# EasyEDA schematic schematic.json
TITLE: Bad Grow Light; REV: 1.3; Date: 2021-09-13; Sheet: 1/1; Drawn By: Jasper; Company: Leaf Debrief
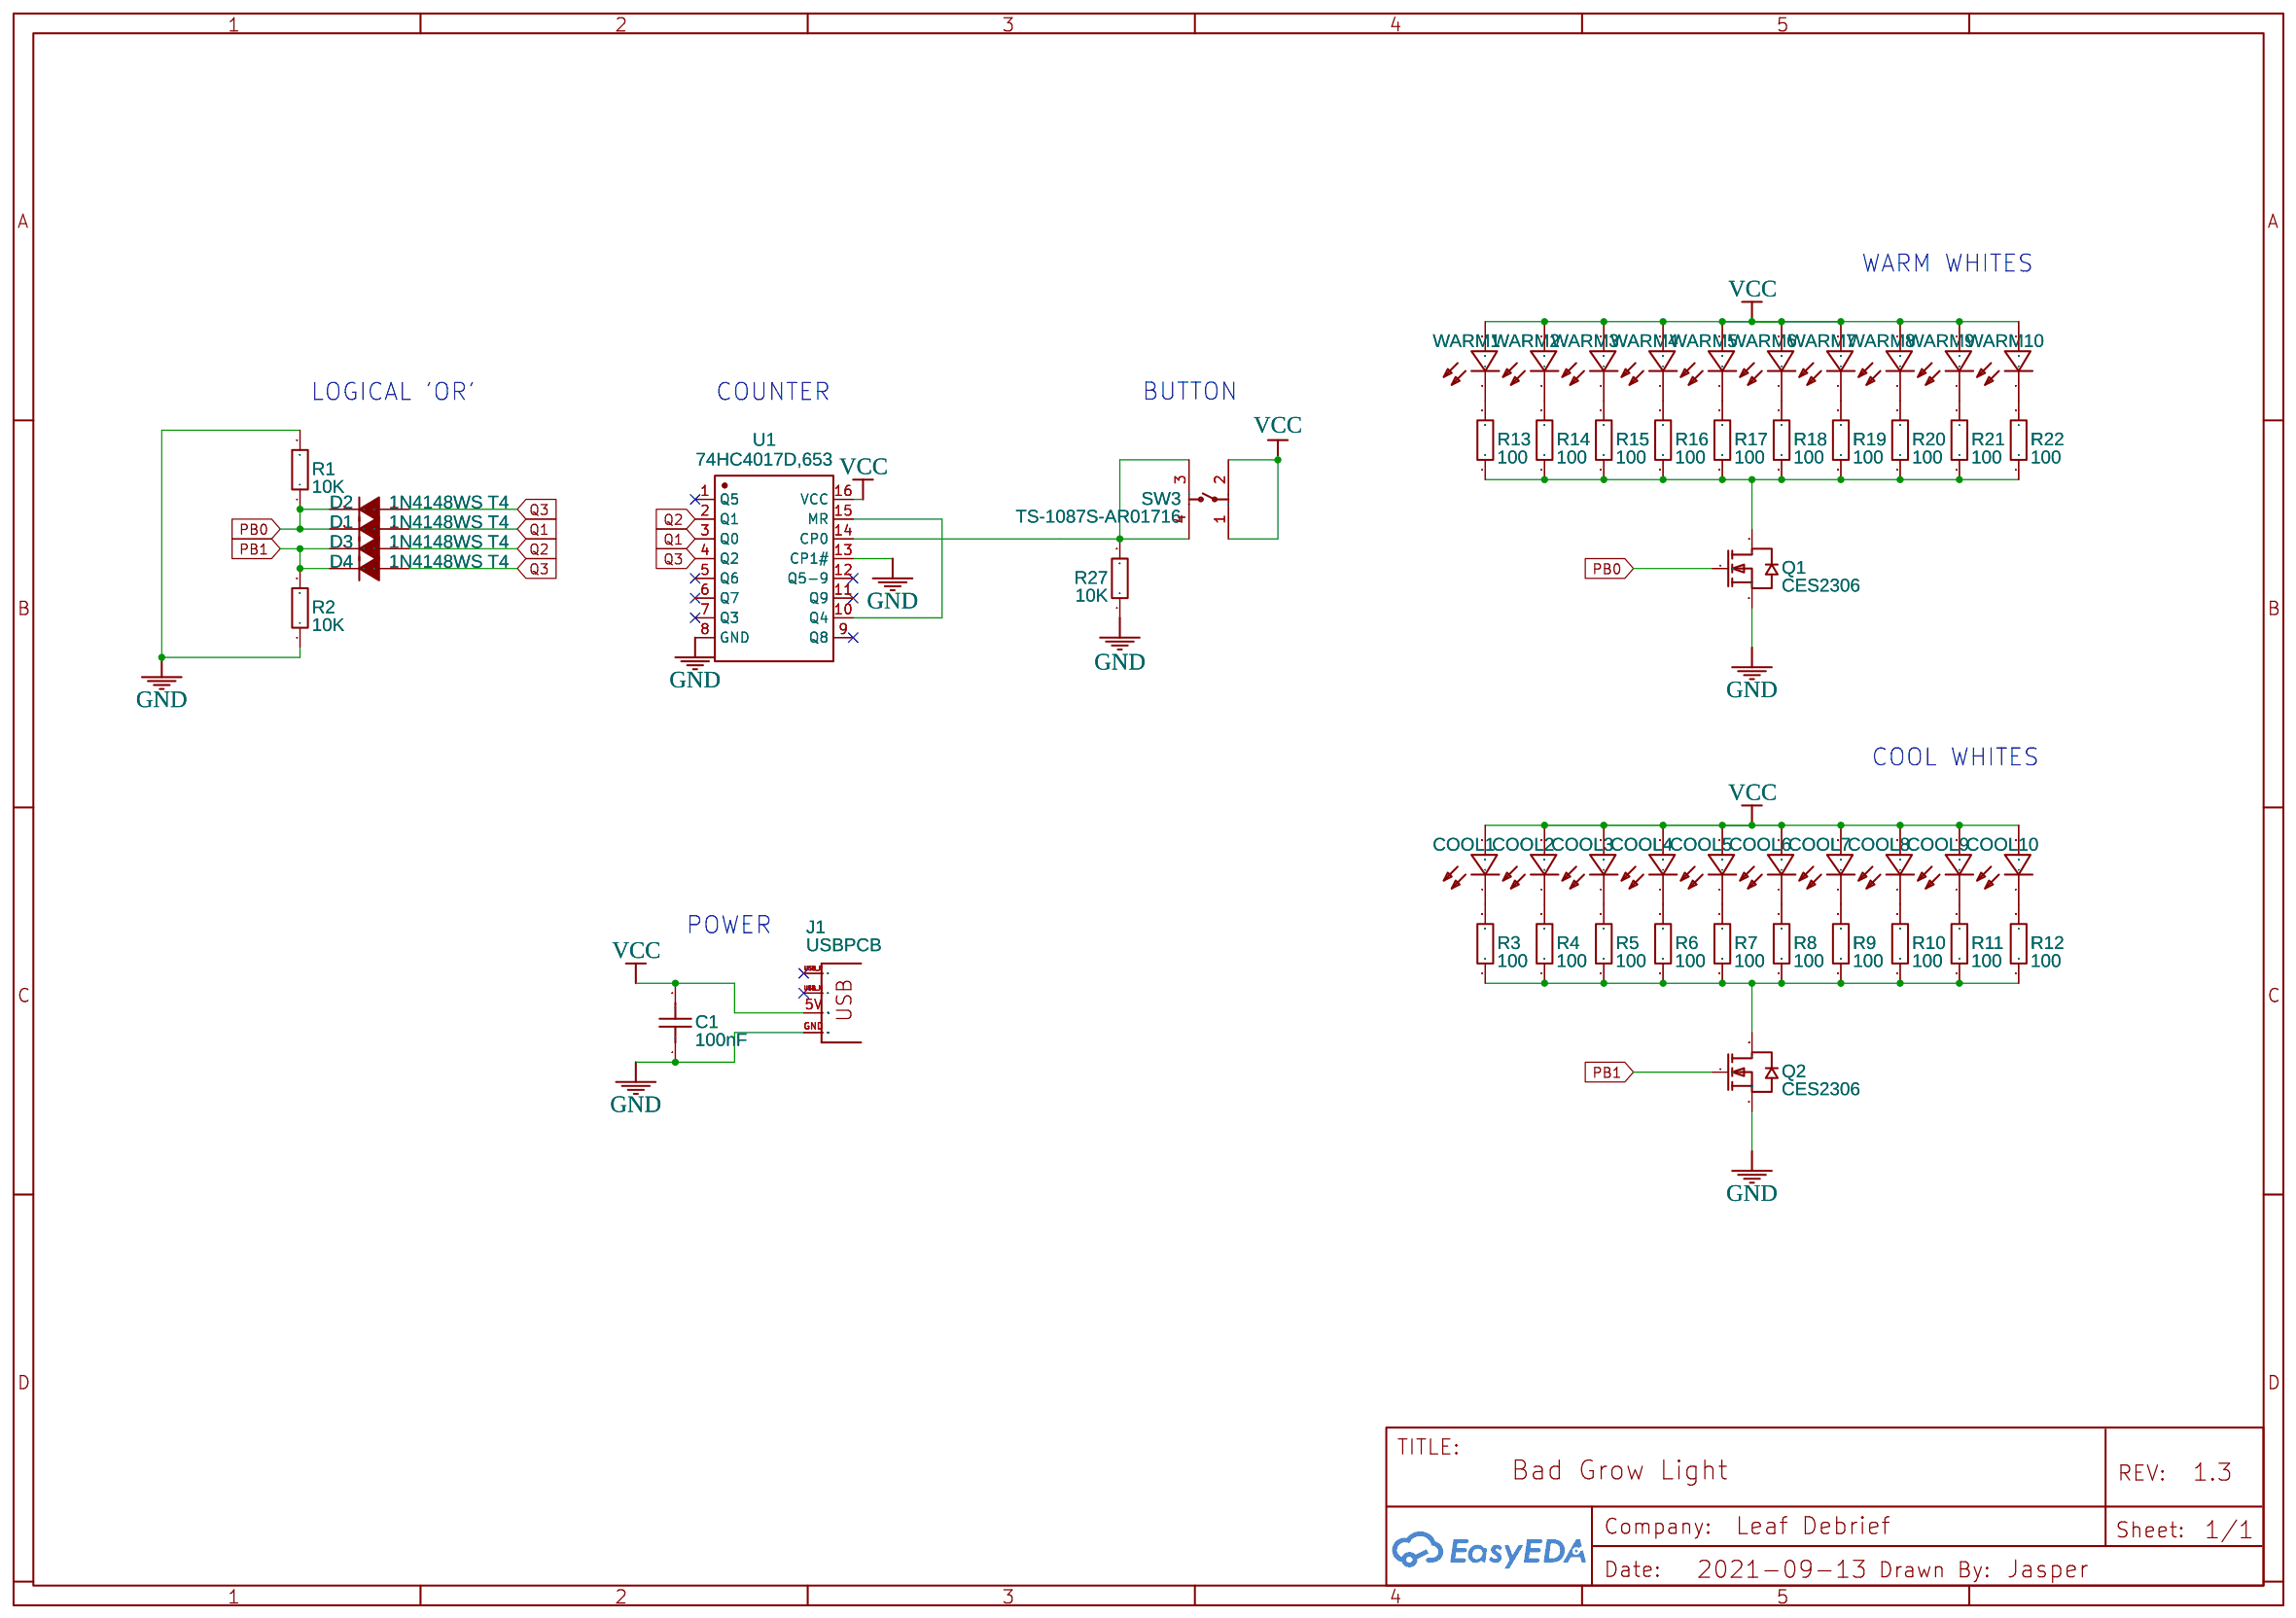
[diagram p0: schematic sheet]

## Parts
C1  100nF  [C0603]
COOL1  HL-A-3014H416W-S1-08HL-HR3_C210338  [5730]
COOL2  HL-A-3014H416W-S1-08HL-HR3_C210338  [5730]
COOL3  HL-A-3014H416W-S1-08HL-HR3_C210338  [5730]
COOL4  HL-A-3014H416W-S1-08HL-HR3_C210338  [5730]
COOL5  HL-A-3014H416W-S1-08HL-HR3_C210338  [5730]
COOL6  HL-A-3014H416W-S1-08HL-HR3_C210338  [5730]
COOL7  HL-A-3014H416W-S1-08HL-HR3_C210338  [5730]
COOL8  HL-A-3014H416W-S1-08HL-HR3_C210338  [5730]
COOL9  HL-A-3014H416W-S1-08HL-HR3_C210338  [5730]
COOL10  HL-A-3014H416W-S1-08HL-HR3_C210338  [5730]
D1  1N4148WS T4  [SOD-323_L1.8-W1.3-LS2.5-RD]
D2  1N4148WS T4  [SOD-323_L1.8-W1.3-LS2.5-RD]
D3  1N4148WS T4  [SOD-323_L1.8-W1.3-LS2.5-RD]
D4  1N4148WS T4  [SOD-323_L1.8-W1.3-LS2.5-RD]
J1  USBPCB  [USB-A-PCB]
Q1  CES2306  [SOT-23-3_L2.9-W1.3-P1.90-LS2.4-BR]
Q2  CES2306  [SOT-23-3_L2.9-W1.3-P1.90-LS2.4-BR]
R1  10K  [R0603]
R2  10K  [R0603]
R3  100  [R0805]
R4  100  [R0805]
R5  100  [R0805]
R6  100  [R0805]
R7  100  [R0805]
R8  100  [R0805]
R9  100  [R0805]
R10  100  [R0805]
R11  100  [R0805]
R12  100  [R0805]
R13  100  [R0805]
R14  100  [R0805]
R15  100  [R0805]
R16  100  [R0805]
R17  100  [R0805]
R18  100  [R0805]
R19  100  [R0805]
R20  100  [R0805]
R21  100  [R0805]
R22  100  [R0805]
R27  10K  [R0603]
SW3  TS-1087S-AR01716  [SW-SMD_4P-L5.1-W5.1-P3.70-LS6.5-TL-2]
U1  74HC4017D,653  [SOIC-16_L10.8-W4.5-P1.27-LS6.8-BL]
WARM1  HL-A-3014H416W-S1-08HL-HR3_C210338  [5730]
WARM2  HL-A-3014H416W-S1-08HL-HR3_C210338  [5730]
WARM3  HL-A-3014H416W-S1-08HL-HR3_C210338  [5730]
WARM4  HL-A-3014H416W-S1-08HL-HR3_C210338  [5730]
WARM5  HL-A-3014H416W-S1-08HL-HR3_C210338  [5730]
WARM6  HL-A-3014H416W-S1-08HL-HR3_C210338  [5730]
WARM7  HL-A-3014H416W-S1-08HL-HR3_C210338  [5730]
WARM8  HL-A-3014H416W-S1-08HL-HR3_C210338  [5730]
WARM9  HL-A-3014H416W-S1-08HL-HR3_C210338  [5730]
WARM10  HL-A-3014H416W-S1-08HL-HR3_C210338  [5730]

## Library data of the parts
C1 = CC0603KRX7R9BB104: Supplier: LCSC; Manufacturer: YAGEO; Supplier Part: C14663; JLCPCB Part Class: Basic Part
COOL1-COOL10 WARM1-WARM10 = HL-A-3014H416W-S1-08HL-HR3_C210338: Supplier: LCSC; Supplier Part: C210338; Manufacturer: Hongli Zhihui (HONGLITRONIC); Contributor: LCSC; JLCPCB Part Class: Extended Part
D1-D4 = 1N4148WS T4: Supplier: LCSC; Manufacturer: CJ; Supplier Part: C2128; JLCPCB Part Class: Basic Part
J1 = USBPCB: Contributor: Teguh Muji Wiyono (RotwaRAW)
Q1 Q2 = CES2306: Supplier: LCSC; Supplier Part: C154290; Manufacturer: Chino-Excel Tech; Contributor: LCSC; JLCPCB Part Class: Extended Part
R1 R2 R27 = AC0603FR-0710KL: Supplier: LCSC; Manufacturer: YAGEO; Supplier Part: C116677; JLCPCB Part Class: Extended Part; Resistance: 10kΩ
R3-R22 = 0603WAJ0101T5E: Supplier: LCSC; Manufacturer: UniOhm; Supplier Part: C25201; JLCPCB Part Class: Extended Part
SW3 = TS-1087S-AR01716: Supplier: LCSC; Supplier Part: C720466; Manufacturer: XUNPU; Contributor: LCSC; JLCPCB Part Class: Extended Part
U1 = 74HC4017D,653: Supplier: LCSC; Manufacturer: Nexperia; Contributor: LCSC; Supplier Part: C148206; JLCPCB Part Class: Extended Part

## Nets
GND: C1.1 J1.GND Q1.2(S) Q2.2(S) R1.2 R2.1 R27.1 U1.8(GND) U1.13(CP1#)
VCC: C1.2 COOL1.2 COOL2.2 COOL3.2 COOL4.2 COOL5.2 COOL6.2 COOL7.2 COOL8.2 COOL9.2 COOL10.2 J1.5V(VBUS) SW3.1 SW3.2 U1.16(VCC) WARM1.2 WARM2.2 WARM3.2 WARM4.2 WARM5.2 WARM6.2 WARM7.2 WARM8.2 WARM9.2 WARM10.2
PB0: D1.1(K) D2.1(K) Q1.1(G) R1.1
PB1: D3.1(K) D4.1(K) Q2.1(G) R2.2
Q1: D1.2(A) U1.3(Q0)
Q2: D3.2(A) U1.2(Q1)
Q3: D2.2(A) D4.2(A) U1.4(Q2)
Net-(COOL1-1): COOL1.1 R3.2
Net-(COOL2-1): COOL2.1 R4.2
Net-(COOL3-1): COOL3.1 R5.2
Net-(COOL4-1): COOL4.1 R6.2
Net-(COOL5-1): COOL5.1 R7.2
Net-(COOL6-1): COOL6.1 R8.2
Net-(COOL7-1): COOL7.1 R9.2
Net-(COOL8-1): COOL8.1 R10.2
Net-(COOL9-1): COOL9.1 R11.2
Net-(COOL10-1): COOL10.1 R12.2
Net-(Q1-3): Q1.3(D) R13.1 R14.1 R15.1 R16.1 R17.1 R18.1 R19.1 R20.1 R21.1 R22.1
Net-(Q2-3): Q2.3(D) R3.1 R4.1 R5.1 R6.1 R7.1 R8.1 R9.1 R10.1 R11.1 R12.1
Net-(R13-2): R13.2 WARM1.1
Net-(R14-2): R14.2 WARM2.1
Net-(R15-2): R15.2 WARM3.1
Net-(R16-2): R16.2 WARM4.1
Net-(R17-2): R17.2 WARM5.1
Net-(R18-2): R18.2 WARM6.1
Net-(R19-2): R19.2 WARM7.1
Net-(R20-2): R20.2 WARM8.1
Net-(R21-2): R21.2 WARM9.1
Net-(R22-2): R22.2 WARM10.1
Net-(R27-2): R27.2 SW3.3 SW3.4 U1.14(CP0)
Net-(U1-10): U1.10(Q4) U1.15(MR)

Not connected (* = marked no-connect by the designer): J1 USB_M(D-)* USB_P(D+)*; U1 1(Q5)* 5(Q6)* 6(Q7)* 7(Q3)* 9(Q8)* 11(Q9)* 12(Q5-9)*

## Notes on the sheet
- WARM WHITES
- LOGICAL 'OR'
- COUNTER
- BUTTON
- COOL WHITES
- POWER
